# Altium schematic sheet BSPD_mod_0513.SchDoc (part 3 of 3)
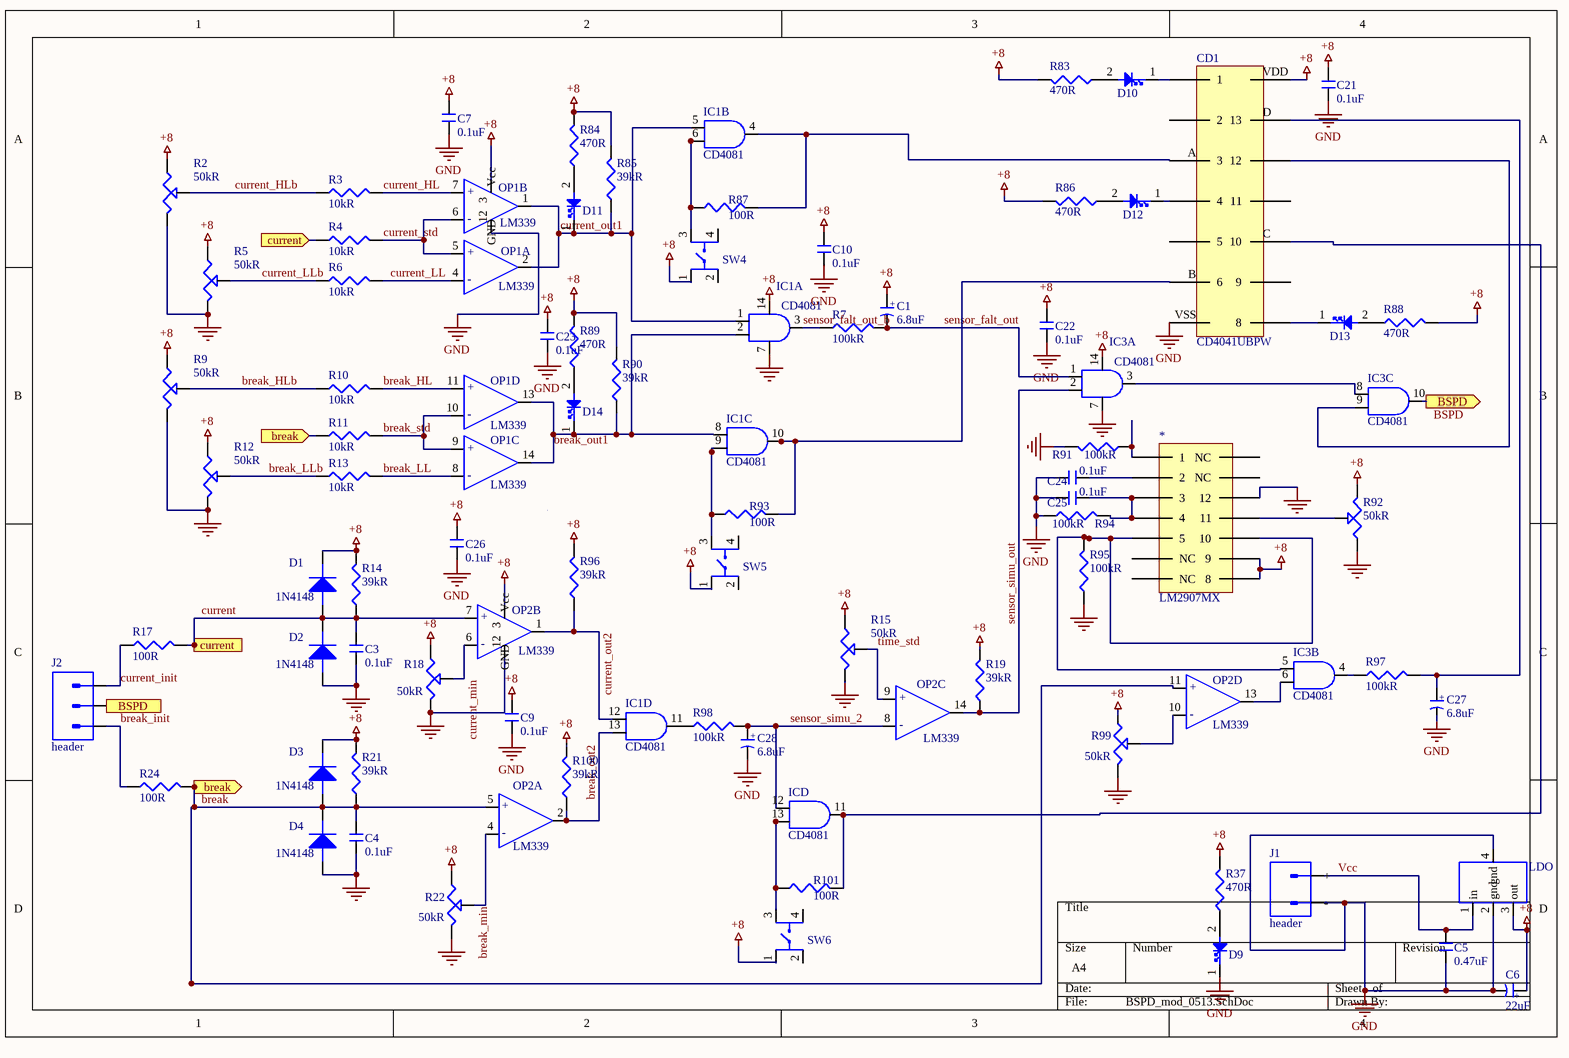
[diagram p2: BSPD_mod_0513.SchDoc]

## Library data of the parts (continued)
J2 = header-5-103635-2: Conn Shrouded Header (4 Sides) HDR 3 POS 2.54mm Solder RA Thru-Hole Box/Tube; Manufacturer: TE Connectivity; Contact Resistance: 15mR; Current Rating: 3A; Number of Positions: 3; Insulation Resistance: 5GR; Connector Type: Plug; Backwall/Post Interruptions: No (Without); Contact Retention: Yes (With); Plating Thickness: 2.54um; PCB Mount Retention: Without; PCB Mounting Orientation: Right Angle; Row Spacing: 0.1inch; Tail Length: 3.3mm; Approvals: CSA; Supplier 1: Mouser; Manufacturer Part Number: 5-103635-2; Stock 1: 3096; Pricing 1: 1 = 1.32000, 10 = 1.10000, 100 = 0.96700, 500 = 0.85900, 1000 = 0.76400, 2500 = 0.73500 (USD); Mount: Through Hole; Contact Plating: Gold; Contact Material: Brass; Color: Black; Housing Color: Black; Housing Material: Thermoplastic; Contact Shape: Square; Min Operating Temperature: -65°C; Max Operating Temperature: 105°C; Number of Rows: 1; Packaging: Rail/Tube; Contact Gender: Male; Package Quantity: 52; Termination: Crimp; Number of Contacts: 3; Orientation: Right Angle; Mating Alignment: Yes (With); Mating Retention: Yes (With); PCB Mount Alignment: No (Without); Strain Relief: No (Without); Contact Current Rating: 3A; Length: 0.4inch; Height: 13.59mm; Lead Pitch: 2.54mm; Width: 0.4inch; Pitch: 2.54mm; Contact Mating Length: 0.23inch; Depth: 13.59mm; REACH SVHC: No SVHC; Flammability Rating: UL94 V-0; ComponentLink1URL: https://datasheet.ciiva.com/30493/0900766b80f9a68b-30493124.pdf?src-supplier=RSComponents; ComponentLink1Description: https://datasheet.ciiva.com/30493/0900766b80f9a68b-30493124.pdf?src-supplier=RSComponents; ComponentLink2URL: https://datasheet.ciiva.com/19461/752798-19461418.pdf?src-supplier=Jameco; ComponentLink2Description: https://datasheet.ciiva.com/19461/752798-19461418.pdf?src-supplier=Jameco; ComponentLink3URL: https://datasheet.ciiva.com/30057/eng-cs-1307819-section-5-cont-0808-30057509.pdf?src-supplier=Onlinecomponents.com; ComponentLink3Description: https://datasheet.ciiva.com/30057/eng-cs-1307819-section-5-cont-0808-30057509.pdf?src-supplier=Onlinecomponents.com; ComponentLink4URL: https://datasheet.ciiva.com/16684/eng-cs-1307819-section-5-cont-0808-16684822.pdf?src-supplier=Avnet+Europe; ComponentLink4Description: https://datasheet.ciiva.com/16684/eng-cs-1307819-section-5-cont-0808-16684822.pdf?src-supplier=Avnet+Europe; ComponentLink5URL: https://datasheet.ciiva.com/46442/1829811-46442918.pdf?src-supplier=Element14; ComponentLink5Description: https://datasheet.ciiva.com/46442/1829811-46442918.pdf?src-supplier=Element14; ComponentLink6URL: https://datasheet.ciiva.com/710/eng-cd-103635-s2-710040.pdf?src-supplier=Digi-Key; ComponentLink6Description: https://datasheet.ciiva.com/710/eng-cd-103635-s2-710040.pdf?src-supplier=Digi-Key; ComponentLink7URL: https://datasheet.ciiva.com/3118/eng-cs-1307819-section-5-cont-0808-3118264.pdf?src-supplier=Avnet; ComponentLink7Description: https://datasheet.ciiva.com/3118/eng-cs-1307819-section-5-cont-0808-3118264.pdf?src-supplier=Avnet; ComponentLink8URL: https://datasheet.ciiva.com/6005/eng-cd-103635-s2-6005515.pdf?src-supplier=Farnell; ComponentLink8Description: https://datasheet.ciiva.com/6005/eng-cd-103635-s2-6005515.pdf?src-supplier=Farnell; ComponentLink9URL: https://datasheet.ciiva.com/7703/1650927-7703291.pdf?src-supplier=Element14; ComponentLink9Description: https://datasheet.ciiva.com/7703/1650927-7703291.pdf?src-supplier=Element14; ComponentLink10URL: https://datasheet.ciiva.com/16375/eng-ds-4-1773458-0-ampmodu-mte-interconnect-sys-0411-16375323.pdf?src-supplier=Future+Electronics; ComponentLink10Description: https://datasheet.ciiva.com/16375/eng-ds-4-1773458-0-ampmodu-mte-interconnect-sys-0411-16375323.pdf?src-supplier=Future+Electronics; ComponentLink11URL: http://datasheet.octopart.com/5-103635-2-TE-Connectivity-datasheet-11077636.pdf?src-supplier=Newark; ComponentLink11Description: http://datasheet.octopart.com/5-103635-2-TE-Connectivity-datasheet-11077636.pdf?src-supplier=Newark; ComponentLink12URL: http://datasheet.octopart.com/5-103635-2-TE-Connectivity-datasheet-136861139.pdf?src-supplier=ShanghaiCT; ComponentLink12Description: http://datasheet.octopart.com/5-103635-2-TE-Connectivity-datasheet-136861139.pdf?src-supplier=ShanghaiCT; ComponentLink13URL: http://datasheet.octopart.com/5-103635-2-TE-Connectivity-datasheet-8324834.pdf?src-supplier=Element14; ComponentLink13Description: http://datasheet.octopart.com/5-103635-2-TE-Connectivity-datasheet-8324834.pdf?src-supplier=Element14; ComponentLink14URL: http://sigma.octopart.com/15108146/technical_drawing/TE-Connectivity-5-103635-2.pdf?src-supplier=TE+Connectivity; ComponentLink14Description: http://sigma.octopart.com/15108146/technical_drawing/TE-Connectivity-5-103635-2.pdf?src-supplier=TE+Connectivity; ComponentLink15URL: http://sigma.octopart.com/101748647/technical_drawing/TE-Connectivity-5-103635-2.pdf?src-supplier=Future+Electronics; ComponentLink15Description: http://sigma.octopart.com/101748647/technical_drawing/TE-Connectivity-5-103635-2.pdf?src-supplier=Future+Electronics; ComponentLink16URL: http://datasheet.octopart.com/5-103635-2-Agastat-datasheet-13560061.pdf?src-supplier=Element14; ComponentLink16Description: http://datasheet.octopart.com/5-103635-2-Agastat-datasheet-13560061.pdf?src-supplier=Element14; ComponentLink17URL: http://sigma.octopart.com/67302833/technical_drawing/TE-Connectivity-5-103635-2.pdf?src-supplier=TE+Connectivity; ComponentLink17Description: http://sigma.octopart.com/67302833/technical_drawing/TE-Connectivity-5-103635-2.pdf?src-supplier=TE+Connectivity; ComponentLink18URL: http://datasheet.octopart.com/5-103635-2-TE-Connectivity---AMP-datasheet-27832635.pdf?src-supplier=Farnell; ComponentLink18Description: http://datasheet.octopart.com/5-103635-2-TE-Connectivity---AMP-datasheet-27832635.pdf?src-supplier=Farnell; ComponentLink19URL: http://datasheet.octopart.com/5-103635-2-TE-Connectivity-datasheet-9784454.pdf?src-supplier=Allied+Electronics; ComponentLink19Description: http://datasheet.octopart.com/5-103635-2-TE-Connectivity-datasheet-9784454.pdf?src-supplier=Allied+Electronics; ComponentLink20URL: http://datasheet.octopart.com/5-103635-2-TE-Connectivity-datasheet-7579224.pdf?src-supplier=Jameco; ComponentLink20Description: http://datasheet.octopart.com/5-103635-2-TE-Connectivity-datasheet-7579224.pdf?src-supplier=Jameco; ComponentLink21URL: http://datasheet.octopart.com/5-103635-2-Tyco-Electronics-datasheet-8817976.pdf?src-supplier=Farnell; ComponentLink21Description: http://datasheet.octopart.com/5-103635-2-Tyco-Electronics-datasheet-8817976.pdf?src-supplier=Farnell; ComponentLink22URL: http://datasheet.octopart.com/5-103635-2-Tyco-Electronics-datasheet-508243.pdf?src-supplier=Farnell; ComponentLink22Description: http://datasheet.octopart.com/5-103635-2-Tyco-Electronics-datasheet-508243.pdf?src-supplier=Farnell; ComponentLink23URL: http://datasheet.octopart.com/5-103635-2-Tyco-Electronics-datasheet-529336.pdf?src-supplier=Farnell; ComponentLink23Description: http://datasheet.octopart.com/5-103635-2-Tyco-Electronics-datasheet-529336.pdf?src-supplier=Farnell; ComponentLink24URL: http://datasheet.octopart.com/5-103635-2-Tyco-Electronics-datasheet-5313028.pdf?src-supplier=Farnell; ComponentLink24Description: http://datasheet.octopart.com/5-103635-2-Tyco-Electronics-datasheet-5313028.pdf?src-supplier=Farnell; ComponentLink25URL: http://datasheet.octopart.com/5-103635-2-Tyco-Electronics-datasheet-5314212.pdf?src-supplier=Farnell; ComponentLink25Description: http://datasheet.octopart.com/5-103635-2-Tyco-Electronics-datasheet-5314212.pdf?src-supplier=Farnell; ComponentLink26URL: http://datasheet.octopart.com/5-103635-2-Tyco-Electronics-datasheet-5388268.pdf?src-supplier=Farnell; ComponentLink26Description: http://datasheet.octopart.com/5-103635-2-Tyco-Electronics-datasheet-5388268.pdf?src-supplier=Farnell; ComponentLink27URL: http://datasheet.octopart.com/5-103635-2-Tyco-Electronics-datasheet-5398832.pdf?src-supplier=Farnell; ComponentLink27Description: http://datasheet.octopart.com/5-103635-2-Tyco-Electronics-datasheet-5398832.pdf?src-supplier=Farnell; ComponentLink28URL: http://datasheet.octopart.com/5-103635-2-Tyco-Electronics-datasheet-5403185.pdf?src-supplier=Farnell; ComponentLink28Description: http://datasheet.octopart.com/5-103635-2-Tyco-Electronics-datasheet-5403185.pdf?src-supplier=Farnell; ComponentLink29URL: http://datasheet.octopart.com/5-103635-2-Tyco-Electronics-datasheet-5458970.pdf?src-supplier=Farnell; ComponentLink29Description: http://datasheet.octopart.com/5-103635-2-Tyco-Electronics-datasheet-5458970.pdf?src-supplier=Farnell; ComponentLink30URL: http://datasheet.octopart.com/5-103635-2-Tyco-Electronics-datasheet-13560510.pdf?src-supplier=Farnell; ComponentLink30Description: http://datasheet.octopart.com/5-103635-2-Tyco-Electronics-datasheet-13560510.pdf?src-supplier=Farnell; ComponentLink31URL: http://datasheet.octopart.com/5-103635-2-TE-Connectivity---AMP-datasheet-8817613.pdf?src-supplier=Sager+Electronics; ComponentLink31Description: http://datasheet.octopart.com/5-103635-2-TE-Connectivity---AMP-datasheet-8817613.pdf?src-supplier=Sager+Electronics; Supplier Part Number 1: 571-5-103635-2
LDO = LM2940IMPX-8.0/NOPB: LDO Regulator Pos 8V 1A 4-Pin(3+Tab) SOT-223 T/R; Manufacturer: Texas Instruments; Dropout Voltage: 500mV; Number of Outputs: 1; Min Input Voltage: 9.4V; Max Input Voltage: 26V; Polarity: Positive; Quiescent Current: 15mA; Output Type: Fixed; Supplier 1: Mouser; Manufacturer Part Number: LM2940IMPX-8.0/NOPB; Stock 1: 3837; Pricing 1: 1 = 1.55000, 10 = 1.32000, 100 = 1.05000, 500 = 0.92300, 1000 = 0.76500, 2000 = 0.71200 (USD); Mount: Surface Mount; Case/Package: TO-261-4; Number of Pins: 4; Min Operating Temperature: -40°C; Max Operating Temperature: 125°C; Packaging: Tape and Reel; Output Voltage: 8V; Package Quantity: 2000; Output Current: 1A; Max Output Current: 1A; Number of Regulators: 1; Radiation Hardening: No; Lead Free: Lead Free; ComponentLink1URL: https://datasheet.ciiva.com/6583/lm2940-n-6583894.pdf?src-supplier=Digi-Key; ComponentLink1Description: https://datasheet.ciiva.com/6583/lm2940-n-6583894.pdf?src-supplier=Digi-Key; ComponentLink2URL: https://datasheet.ciiva.com/14275/lm2940c-14275563.pdf?src-supplier=Avnet; ComponentLink2Description: https://datasheet.ciiva.com/14275/lm2940c-14275563.pdf?src-supplier=Avnet; ComponentLink3URL: https://datasheet.ciiva.com/26170/lm2940c-26170414.pdf?src-supplier=Avnet+Europe; ComponentLink3Description: https://datasheet.ciiva.com/26170/lm2940c-26170414.pdf?src-supplier=Avnet+Europe; ComponentLink4URL: https://octopart.com/click/track?ai=8629&ct=datasheets&sig=0204b2a&at=physicalpart&sid=370&ppid=24845755&hlid=24887964&src-supplier=TI+store; ComponentLink4Description: https://octopart.com/click/track?ai=8629&ct=datasheets&sig=0204b2a&at=physicalpart&sid=370&ppid=24845755&hlid=24887964&src-supplier=TI+store; ComponentLink5URL: http://datasheet.octopart.com/LM2940IMPX-8.0/NOPB-Texas-Instruments-datasheet-10621823.pdf?src-supplier=TI+store; ComponentLink5Description: http://datasheet.octopart.com/LM2940IMPX-8.0/NOPB-Texas-Instruments-datasheet-10621823.pdf?src-supplier=TI+store; ComponentLink6URL: http://datasheet.octopart.com/LM2940IMPX-8.0-NOPB-Texas-Instruments-datasheet-14775597.pdf?src-supplier=TI+store; ComponentLink6Description: http://datasheet.octopart.com/LM2940IMPX-8.0-NOPB-Texas-Instruments-datasheet-14775597.pdf?src-supplier=TI+store; ComponentLink7URL: http://datasheet.octopart.com/LM2940IMPX-8.0-NOPB-Texas-Instruments-datasheet-34156496.pdf?src-supplier=TI+store; ComponentLink7Description: http://datasheet.octopart.com/LM2940IMPX-8.0-NOPB-Texas-Instruments-datasheet-34156496.pdf?src-supplier=TI+store; ComponentLink8URL: http://datasheet.octopart.com/LM2940IMPX-8.0-NOPB-Texas-Instruments-datasheet-37140193.pdf?src-supplier=TI+store; ComponentLink8Description: http://datasheet.octopart.com/LM2940IMPX-8.0-NOPB-Texas-Instruments-datasheet-37140193.pdf?src-supplier=TI+store; ComponentLink9URL: http://sigma.octopart.com/49253063/technical_drawing/Texas-Instruments-LM2940IMPX-8.0-NOPB.pdf?src-supplier=TI+store; ComponentLink9Description: http://sigma.octopart.com/49253063/technical_drawing/Texas-Instruments-LM2940IMPX-8.0-NOPB.pdf?src-supplier=TI+store; Supplier Part Number 1: 926-LM2940IMPX80NOPB
OP1 OP2 = LM339ADR: Manufacturer: Rochester Electronics; Nominal Supply Current: 2mA; Output Current: 16mA; Number of Channels: 4; Quiescent Current: 800uA; Supplier 1: Mouser; Supplier Part Number 1: 595-LM339ADR; Manufacturer Part Number: LM339ADR; RoHS: No; Stock 1: 22756; Pricing 1: 1 = 0.37000, 10 = 0.27500, 100 = 0.14900, 1000 = 0.11200, 2500 = 0.09700, 10000 = 0.09000 (USD); Case/Package: SOIC; Number of Pins: 14; Packaging: Bulk; Lead Free: Lead Free; REACH SVHC: No SVHC
R2 R5 R9 R12 R15 R18 R22 R92 R99 = 50K可變垂直-3296W-1-503LF: Trimmer; Cermet; Rest 50 Kilohms; PCB; Pwr-Rtg 0.5W; Dim 0.375InLx0.19InWx0.395InH; Manufacturer: Bourns; Tolerance: 10%; Power Rating: 500mW; Number of Turns: 25; Insulation Resistance: 1GR; Temperature Coefficient: 100ppm/°C; Supplier 1: Mouser; Manufacturer Part Number: 3296W-1-503LF; Stock 1: 3535; Pricing 1: 1 = 2.31000, 10 = 1.83000, 50 = 1.76000, 100 = 1.62000, 500 = 1.34000, 1000 = 1.27000, 2000 = 1.09000, 5000 = 1.06000, 10000 = 0.94700 (USD); Mount: Panel; Weight: 0.03oz; Number of Terminals: 3; Color: Blue; Contact Plating: Tin; Min Operating Temperature: -55°C; Max Operating Temperature: 125°C; Resistance: 50kR; Packaging: Rail/Tube; Package Quantity: 50; Composition: Cermet; Termination: Pin; Taper: Linear; Military Standard: Not; Max Power Dissipation: 500mW; Type: Potentiometer; Length: 9.53mm; Height: 0.395inch; Width: 9.53mm; Depth: 4.83mm; Radiation Hardening: No; REACH SVHC: No SVHC; Lead Free: Lead Free; ComponentLink1URL: https://datasheet.ciiva.com/6178/172577-6178371.pdf?src-supplier=Distrelec; ComponentLink1Description: https://datasheet.ciiva.com/6178/172577-6178371.pdf?src-supplier=Distrelec; ComponentLink2URL: https://datasheet.ciiva.com/27747/769485-27747554.pdf?src-supplier=Jameco; ComponentLink2Description: https://datasheet.ciiva.com/27747/769485-27747554.pdf?src-supplier=Jameco; ComponentLink3URL: https://datasheet.ciiva.com/11831/0900766b8069ccf4-11831072.pdf?src-supplier=RSComponents; ComponentLink3Description: https://datasheet.ciiva.com/11831/0900766b8069ccf4-11831072.pdf?src-supplier=RSComponents; ComponentLink4URL: https://datasheet.ciiva.com/29122/447285-da-01-en-trimmer-tht3296w-1-503lf-50k-0-5w-29122369.pdf?src-supplier=Conrad; ComponentLink4Description: https://datasheet.ciiva.com/29122/447285-da-01-en-trimmer-tht3296w-1-503lf-50k-0-5w-29122369.pdf?src-supplier=Conrad; ComponentLink5URL: https://datasheet.ciiva.com/3266/3296-3266197.pdf?src-supplier=Avnet; ComponentLink5Description: https://datasheet.ciiva.com/3266/3296-3266197.pdf?src-supplier=Avnet; ComponentLink6URL: https://datasheet.ciiva.com/2156/3296-2156902.pdf?src-supplier=Digi-Key; ComponentLink6Description: https://datasheet.ciiva.com/2156/3296-2156902.pdf?src-supplier=Digi-Key; ComponentLink7URL: https://datasheet.ciiva.com/25907/3296-25907261.pdf?src-supplier=Avnet+Europe; ComponentLink7Description: https://datasheet.ciiva.com/25907/3296-25907261.pdf?src-supplier=Avnet+Europe; ComponentLink8URL: https://datasheet.ciiva.com/1131/1815117-1131346.pdf?src-supplier=Element14; ComponentLink8Description: https://datasheet.ciiva.com/1131/1815117-1131346.pdf?src-supplier=Element14; ComponentLink9URL: https://datasheet.ciiva.com/20164/68-0300e-20164056.pdf?src-supplier=Rapid+Electronics; ComponentLink9Description: https://datasheet.ciiva.com/20164/68-0300e-20164056.pdf?src-supplier=Rapid+Electronics; ComponentLink10URL: https://datasheet.ciiva.com/30233/3296-30233887.pdf?src-supplier=Onlinecomponents.com; ComponentLink10Description: https://datasheet.ciiva.com/30233/3296-30233887.pdf?src-supplier=Onlinecomponents.com; ComponentLink11URL: http://datasheet.octopart.com/3296W-1-503LF-Bourns-datasheet-9257.pdf?src-supplier=Factory+Futures; ComponentLink11Description: http://datasheet.octopart.com/3296W-1-503LF-Bourns-datasheet-9257.pdf?src-supplier=Factory+Futures; ComponentLink12URL: http://datasheet.octopart.com/3296W-1-503LF-Bourns-datasheet-8754025.pdf?src-supplier=Electro+Sonic; ComponentLink12Description: http://datasheet.octopart.com/3296W-1-503LF-Bourns-datasheet-8754025.pdf?src-supplier=Electro+Sonic; ComponentLink13URL: http://datasheet.octopart.com/3296W-1-503LF-Bourns-datasheet-62345832.pdf?src-supplier=Element14; ComponentLink13Description: http://datasheet.octopart.com/3296W-1-503LF-Bourns-datasheet-62345832.pdf?src-supplier=Element14; ComponentLink14URL: http://datasheet.octopart.com/3296W-1-503LF-Bourns-datasheet-8458046.pdf?src-supplier=Factory+Futures; ComponentLink14Description: http://datasheet.octopart.com/3296W-1-503LF-Bourns-datasheet-8458046.pdf?src-supplier=Factory+Futures; ComponentLink15URL: http://datasheet.octopart.com/3296W-1-503LF-Bourns-datasheet-8359740.pdf?src-supplier=_legacy+Avnet; ComponentLink15Description: http://datasheet.octopart.com/3296W-1-503LF-Bourns-datasheet-8359740.pdf?src-supplier=_legacy+Avnet; ComponentLink16URL: http://datasheet.octopart.com/3296W-1-503LF-Bourns-datasheet-25360155.pdf?src-supplier=Allied+Electronics; ComponentLink16Description: http://datasheet.octopart.com/3296W-1-503LF-Bourns-datasheet-25360155.pdf?src-supplier=Allied+Electronics; ComponentLink17URL: http://datasheet.octopart.com/3296W-1-503LF-Bourns-datasheet-47378.pdf?src-supplier=Allied+Electronics; ComponentLink17Description: http://datasheet.octopart.com/3296W-1-503LF-Bourns-datasheet-47378.pdf?src-supplier=Allied+Electronics; ComponentLink18URL: http://datasheet.octopart.com/3296W-1-503LF-Bourns-datasheet-528316.pdf?src-supplier=Farnell; ComponentLink18Description: http://datasheet.octopart.com/3296W-1-503LF-Bourns-datasheet-528316.pdf?src-supplier=Farnell; ComponentLink19URL: http://datasheet.octopart.com/3296W-1-503LF-Bourns-datasheet-6152.pdf?src-supplier=Farnell; ComponentLink19Description: http://datasheet.octopart.com/3296W-1-503LF-Bourns-datasheet-6152.pdf?src-supplier=Farnell; ComponentLink20URL: http://datasheet.octopart.com/3296W-1-503LF.-Bourns-datasheet-7284159.pdf?src-supplier=Jameco; ComponentLink20Description: http://datasheet.octopart.com/3296W-1-503LF.-Bourns-datasheet-7284159.pdf?src-supplier=Jameco; ComponentLink21URL: http://datasheet.octopart.com/3296W-1-503LF-Bourns-datasheet-14175298.pdf?src-supplier=IIIC; ComponentLink21Description: http://datasheet.octopart.com/3296W-1-503LF-Bourns-datasheet-14175298.pdf?src-supplier=IIIC; ComponentLink22URL: http://datasheet.octopart.com/3296W-1-503LF-Bourns-datasheet-17840116.pdf?src-supplier=Jameco; ComponentLink22Description: http://datasheet.octopart.com/3296W-1-503LF-Bourns-datasheet-17840116.pdf?src-supplier=Jameco; Supplier Part Number 1: 652-3296W-1-503LF
R3 R4 R6 R10 R11 R13 = 10k-CRCW080510K0FKEAC: Res Thick Film 0805 10K Ohm 1% 1/8W ±100ppm/°C Molded SMD Paper T/R; Manufacturer: Vishay; Power Rating: 125mW; Resistance: 10000R; Supplier 1: Mouser; Supplier Part Number 1: 71-CRCW080510K0FKEAC; Manufacturer Part Number: CRCW080510K0FKEAC; Stock 1: 593292; Pricing 1: 1 = 0.10000, 10 = 0.05900, 100 = 0.02400, 1000 = 0.01000, 5000 = 0.00700, 10000 = 0.00600, 25000 = 0.00500 (USD); Case/Package: 0805; Tolerance: 1%; Lead Free: Lead Free; ComponentLink1URL: http://www.vishay.com/docs/28773/crcwce3.pdf?src-supplier=Digi-Key; ComponentLink1Description: http://www.vishay.com/docs/28773/crcwce3.pdf?src-supplier=Digi-Key; ComponentLink2URL: http://datasheet.octopart.com/CRCW080510K0FKEAC-Vishay-datasheet-100063072.pdf?src-supplier=Future+Electronics; ComponentLink2Description: http://datasheet.octopart.com/CRCW080510K0FKEAC-Vishay-datasheet-100063072.pdf?src-supplier=Future+Electronics
R7 R91 R94 R95 R97 R98 = 100k-CRCW0805100KFKEAC: Res Thick Film 0805 100K Ohm 1% 1/8W ±100ppm/°C Molded SMD Paper T/R; Manufacturer: Vishay; Power Rating: 125mW; Supplier 1: Mouser; Supplier Part Number 1: 71-CRCW0805100KFKEAC; Manufacturer Part Number: CRCW0805100KFKEAC; Stock 1: 206602; Pricing 1: 1 = 0.10000, 10 = 0.05900, 100 = 0.02400, 1000 = 0.01000, 5000 = 0.00700, 10000 = 0.00600, 25000 = 0.00500 (USD); Mount: Surface Mount; Case/Package: Molded; Contact Plating: Tin; Min Operating Temperature: -55°C; Max Operating Temperature: 155°C; Composition: Thick Film; Termination: Wraparound; Temperature Coefficient: 100ppm/°C; Resistance: 100kR; Tolerance: 1%; Length: 2mm; Lead Free: Lead Free; ComponentLink1URL: http://www.vishay.com/docs/20035/dcrcwe3.pdf?src-supplier=Avnet+Asia; ComponentLink1Description: http://www.vishay.com/docs/20035/dcrcwe3.pdf?src-supplier=Avnet+Asia; ComponentLink2URL: http://www.vishay.com/docs/28773/crcwce3.pdf?src-supplier=Digi-Key; ComponentLink2Description: http://www.vishay.com/docs/28773/crcwce3.pdf?src-supplier=Digi-Key; ComponentLink3URL: http://datasheet.octopart.com/CRCW0805100KFKEAC-Vishay-datasheet-100063072.pdf?src-supplier=Future+Electronics; ComponentLink3Description: http://datasheet.octopart.com/CRCW0805100KFKEAC-Vishay-datasheet-100063072.pdf?src-supplier=Future+Electronics
R14 R19 R21 R85 R90 R96 R100 = 39k-CRCW080539K0FKEAC: CRCW Thick Film Commodity Chip Resistor 0805 Size 39K Ohm 1% 0.125 W 100 ppm/K 2-Pin SMD Paper T/R; Manufacturer: Vishay; Supplier 1: Mouser; Supplier Part Number 1: 71-CRCW080539K0FKEAC; Manufacturer Part Number: CRCW080539K0FKEAC; Stock 1: 13079; Pricing 1: 1 = 0.16000, 10 = 0.05900, 100 = 0.02400, 1000 = 0.01000, 5000 = 0.00700, 10000 = 0.00600, 25000 = 0.00500 (USD)
R17 R24 R87 R93 R101 = 100-CRCW0805100RFKEAC: Res Thick Film 0805 100 Ohm 1% 1/8W ±100ppm/°C Molded SMD Paper T/R; Manufacturer: Vishay; Power Rating: 125mW; Supplier 1: Mouser; Supplier Part Number 1: 71-CRCW0805100RFKEAC; Manufacturer Part Number: CRCW0805100RFKEAC; Stock 1: 249348; Pricing 1: 1 = 0.10000, 10 = 0.05900, 100 = 0.02400, 1000 = 0.01000, 5000 = 0.00700, 10000 = 0.00600, 25000 = 0.00500 (USD); Case/Package: 0805; Resistance: 100R; Tolerance: 1%; Lead Free: Lead Free; ComponentLink1URL: http://www.vishay.com/docs/28773/crcwce3.pdf?src-supplier=Digi-Key; ComponentLink1Description: http://www.vishay.com/docs/28773/crcwce3.pdf?src-supplier=Digi-Key; ComponentLink2URL: http://datasheet.octopart.com/CRCW0805100RFKEAC-Vishay-datasheet-100063072.pdf?src-supplier=Future+Electronics; ComponentLink2Description: http://datasheet.octopart.com/CRCW0805100RFKEAC-Vishay-datasheet-100063072.pdf?src-supplier=Future+Electronics
R37 R83 R84 R86 R88 R89 = 470-CRCW0805470RFKEAC: Res Thick Film 0805 470 Ohm 1% 1/8W ±100ppm/°C Molded SMD Paper T/R; Manufacturer: Vishay; Power Rating: 125mW; Supplier 1: Mouser; Supplier Part Number 1: 71-CRCW0805470RFKEAC; Manufacturer Part Number: CRCW0805470RFKEAC; Stock 1: 31729; Pricing 1: 1 = 0.10000, 10 = 0.05900, 100 = 0.02400, 1000 = 0.01000, 5000 = 0.00700, 10000 = 0.00600 (USD); Case/Package: 0805; Resistance: 470R; Tolerance: 1%; Lead Free: Lead Free; ComponentLink1URL: http://www.vishay.com/docs/28773/crcwce3.pdf?src-supplier=Digi-Key; ComponentLink1Description: http://www.vishay.com/docs/28773/crcwce3.pdf?src-supplier=Digi-Key
SW4-SW6 = (button)95C06A2T: Switch Tactile N.O. SPST Round Button PC Pins 0.05A 12VDC 0.98N Thru-Hole Bulk; Manufacturer: Grayhill; Mechanical Life: 1000000Cycles; Actuator Material: Nylon; Switch Function: Off-Mom; Max Current Rating: 50mA; Voltage Rating (DC): 12V; Contact Resistance: 100mR; Illumination Type: Non-Illuminated; Switch Travel: 0.25mm; Actuator Type: Standard; Actuator Length: 0.79mm; Supplier 1: Mouser; Manufacturer Part Number: 95C06A2T; Stock 1: 3565; Pricing 1: 1 = 0.29000, 10 = 0.25600, 100 = 0.22100, 1000 = 0.19200, 2000 = 0.15900, 10000 = 0.14800 (USD); Mount: Through Hole; Contact Material: Brass; Contact Plating: Silver; Min Operating Temperature: -25°C; Max Operating Temperature: 70°C; Orientation: Straight; Throw Configuration: SPST; Operating Force: 0.98N; Packaging: Bulk; Max Voltage Rating (DC): 12V; Termination: PC Pins; Electrical Life: 1000000Cycles; Length: 6.2mm; Depth: 6.2mm; Lead Free: Lead Free; ComponentLink1URL: https://datasheet.ciiva.com/2901/tact-95c06-2901680.pdf?src-supplier=Digi-Key; ComponentLink1Description: https://datasheet.ciiva.com/2901/tact-95c06-2901680.pdf?src-supplier=Digi-Key; ComponentLink2URL: https://datasheet.ciiva.com/16425/tact-95c06-16425018.pdf?src-supplier=Future+Electronics; ComponentLink2Description: https://datasheet.ciiva.com/16425/tact-95c06-16425018.pdf?src-supplier=Future+Electronics; ComponentLink3URL: https://datasheet.ciiva.com/16154/66tact-95c06-16154718.pdf?src-supplier=Onlinecomponents.com; ComponentLink3Description: https://datasheet.ciiva.com/16154/66tact-95c06-16154718.pdf?src-supplier=Onlinecomponents.com; ComponentLink4URL: http://datasheet.octopart.com/95C06A2T-Grayhill-datasheet-8326586.pdf?src-supplier=Sager+Electronics; ComponentLink4Description: http://datasheet.octopart.com/95C06A2T-Grayhill-datasheet-8326586.pdf?src-supplier=Sager+Electronics; ComponentLink5URL: http://datasheet.octopart.com/95C06A2T-Grayhill-datasheet-41175902.pdf?src-supplier=Electro+Sonic; ComponentLink5Description: http://datasheet.octopart.com/95C06A2T-Grayhill-datasheet-41175902.pdf?src-supplier=Electro+Sonic; ComponentLink6URL: http://datasheet.octopart.com/95C06A2T-Grayhill-datasheet-112065354.pdf?src-supplier=Newark; ComponentLink6Description: http://datasheet.octopart.com/95C06A2T-Grayhill-datasheet-112065354.pdf?src-supplier=Newark; Supplier Part Number 1: 706-95C06A2T